# Altium schematic sheet RS485.SchDoc
size B; Author: AM; CompanyName: Expatria Technologies; DrawnBy: A.Marles; Engineer: AM; Organization: Expatria Technologies; DocumentNumber: 11; Revision: A1; SheetNumber: 11; SheetTotal: 14; PCB_Rev: A1
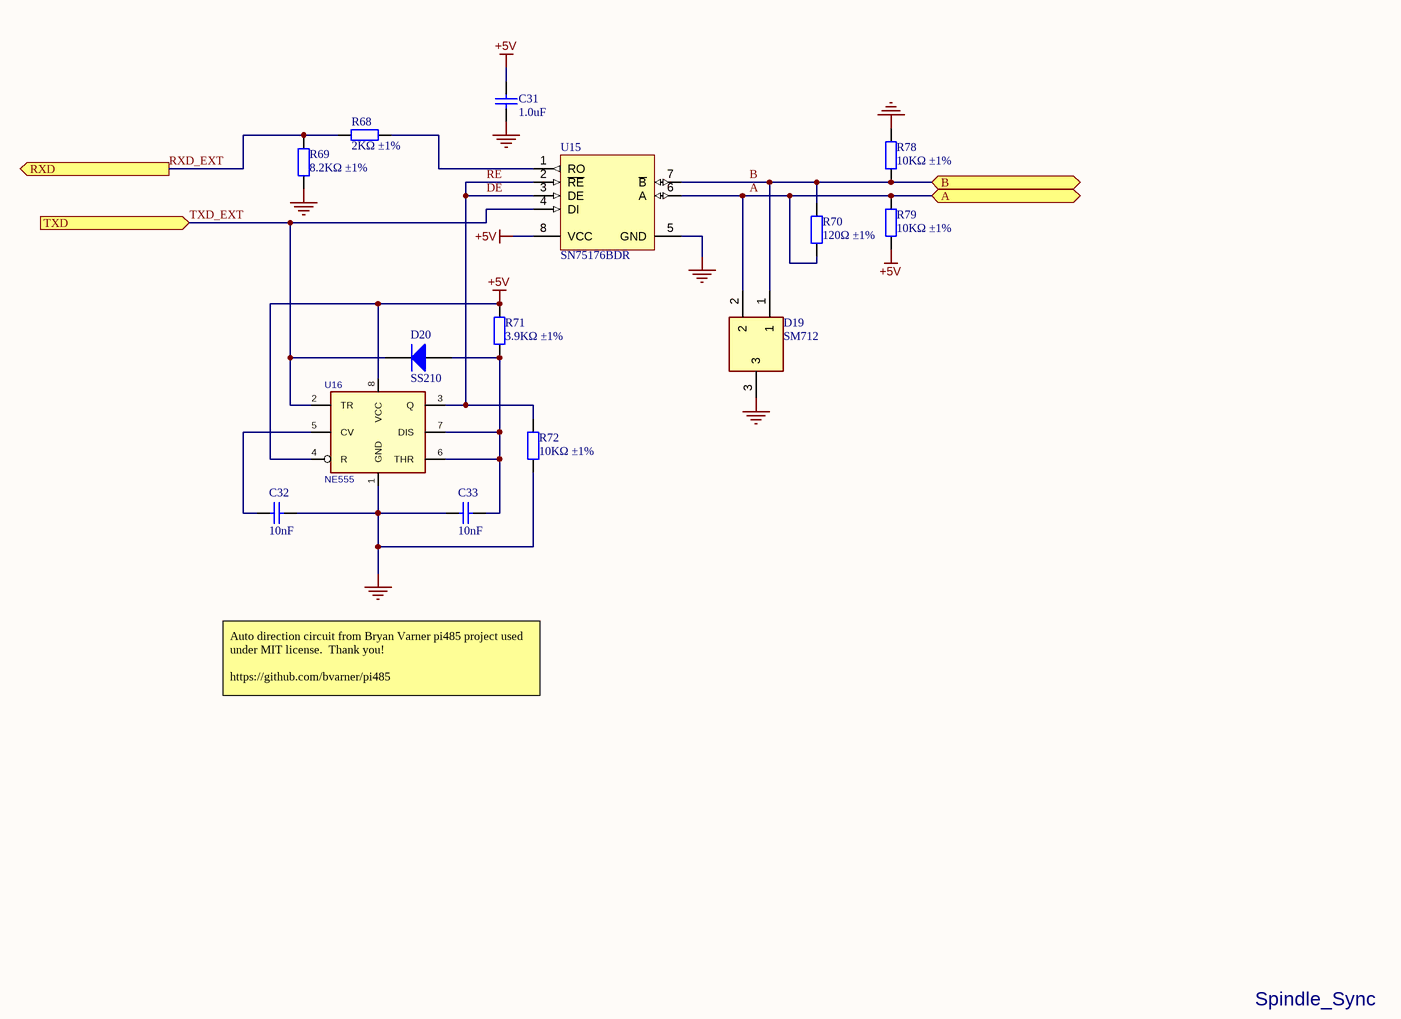
[diagram p0: RS485.SchDoc]

## Parts
C31  1.0uF  [0402_C]
C32  10nF  [0402_C]
C33  10nF  [0402_C]
D19  SM712  [SOT95P230X117-3N]
D20  SS210  [SMA(DO-214AC)_S1]
R68  2KΩ ±1%  [0402_R]
R69  8.2KΩ ±1%  [0402_R]
R70  120Ω ±1%  [0805_R]
R71  3.9KΩ ±1%  [0402_R]
R72  10KΩ ±1%  [0402_R]
R78  10KΩ ±1%  [0402_R]
R79  10KΩ ±1%  [0402_R]
U15  SN75176BDR  [SOIC-8_150mil]
U16  value NE555  [SOIC-8_150mil]  (hidden comment: NE555DR)

## Ports
A (bidir), B (bidir), RXD (out), TXD (in)

## Nets
+5V: C31.2 R71.2 R79.1 U15.8(VCC) U16.4(R) U16.8(VCC)
GND: C31.1 C32.2 C33.1 D19.3 R69.2 R72.1 R78.2 U15.5(GND) U16.1(GND)
A: D19.2 R70.1 R79.2 U15.6(A) ; port A
B: D19.1 R70.2 R78.1 U15.7(~{B}) ; port B
DE: R72.2 U15.2(~{RE}) U15.3(DE) U16.3(Q)  [also labelled RE]
RXD_EXT: R68.2 R69.1 ; port RXD
TXD_EXT: D20.2(K) U15.4(DI) U16.2(TR) ; port TXD
NetC32_1: C32.1 U16.5(CV)
NetC33_2: C33.2 D20.1(A) R71.1 U16.6(THR) U16.7(DIS)
NetR68_1: R68.1 U15.1(RO)

## Notes on the sheet
- Auto direction circuit from Bryan Varner pi485 project used under MIT license.  Thank you!
  https://github.com/bvarner/pi485
- Spindle_Sync
- SHEET
- Expatria Technologies
- 1136 Glade Court
- Port Coquitlam, BC V3B 1R5
- PROJECT
- SIZE
- ENGR
- MODIFIED
- DOCUMENT
- REV
- Copyright Expatria Technologies 2021.  This document describes Open Hardware and is licensed under the CERN-OHL-P  v2.  No warranty is implied or expressed.
- EMAIL: INFO@EXPATRIA.CA
- B
- /

## Library data of the parts
C31 = 0402 1.0uF (105) 10% 25V: Chip capacitor; Manufacturer: Samsung Electro-Mechanics; PartNumber: CL05A105KA5NQNC; Capacitance: 1uF; Tolerance: 10%; Voltage: 25V; Package: 0402; Supplier: LC; SuppliersPartNumber: C52923
C32 C33 = 0402 10nF (103) 10% 50V: Chip capacitors; Manufacturer: Samsung Electro-Mechanics; PartNumber: CL05B103KB5NNNC; Tolerance: 10%; Voltage: 50V; Package: 0402; Supplier: LC; SuppliersPartNumber: C15195; Capacitance: 10nF
D19 = CDSOT23-SM712: Bidirectional 12V (Max), 7V (Max) 7.5V / 13.3V 10V / 20V 12A(8/20us) SOT-23-3 TVS RoHS; Manufacturer_Name: DOWO; Height: 1.17mm; Manufacturer_Part_Number: SM712; SuppliersPartNumber: C293966
D20 = SMA(DO-214AC) SS210: 二极管; Package: SMA(DO-214AC); Supplier: LC; SuppliersPartNumber: C14996
R68 = 0402 2K (2001) 1%: Chip resistor; Manufacturer: Uniroyal Elec; PartNumber: 0402WGF2001TCE; Power: 1/16W; Package: 0402; Supplier: LC; SuppliersPartNumber: C4109; Resistance: 2KΩ; Tolerance: 1%
R69 = 0402 8.2K (8201) 1%: Chip resistor; Manufacturer: Uniroyal Elec; PartNumber: 0402WGF8201TCE; Power: 1/16W; Package: 0402; Supplier: LC; SuppliersPartNumber: C25924; Resistance: 8.2KΩ; Tolerance: 1%
R70 = 0805 120R (1200) 1%: Chip resistor; Manufacturer: Uniroyal Elec; Power: 1/8W; Package: 0805; Supplier: LC; SuppliersPartNumber: C17437; Tolerance: 1%
R71 = 0402 3.9K (3901) 1%: Chip resistor; Manufacturer: Uniroyal Elec; PartNumber: 0402WGF3901TCE; Power: 1/16W; Package: 0402; Supplier: LC; SuppliersPartNumber: C51721; Resistance: 3.9KΩ; Tolerance: 1%
R72 R78 R79 = 0402 10K (1002) 1%: Chip resistor; Manufacturer: Uniroyal Elec; PartNumber: 0402WGF1002TCE; Power: 1/16W; Package: 0402; Supplier: LC; SuppliersPartNumber: C25744; Resistance: 10KΩ; Tolerance: 1%
U15 = SN75176BDR_[C7063]: RS-485/RS-422; Package: SOIC-8_150mil; Supplier: LC; SuppliersPartNumber: C7063
U16 = NE555: SuppliersPartNumber: C7593; Supplier: LC